# EAGLE schematic Z80 DEV BOARD REV 1 (EAGLE 9.5.2)
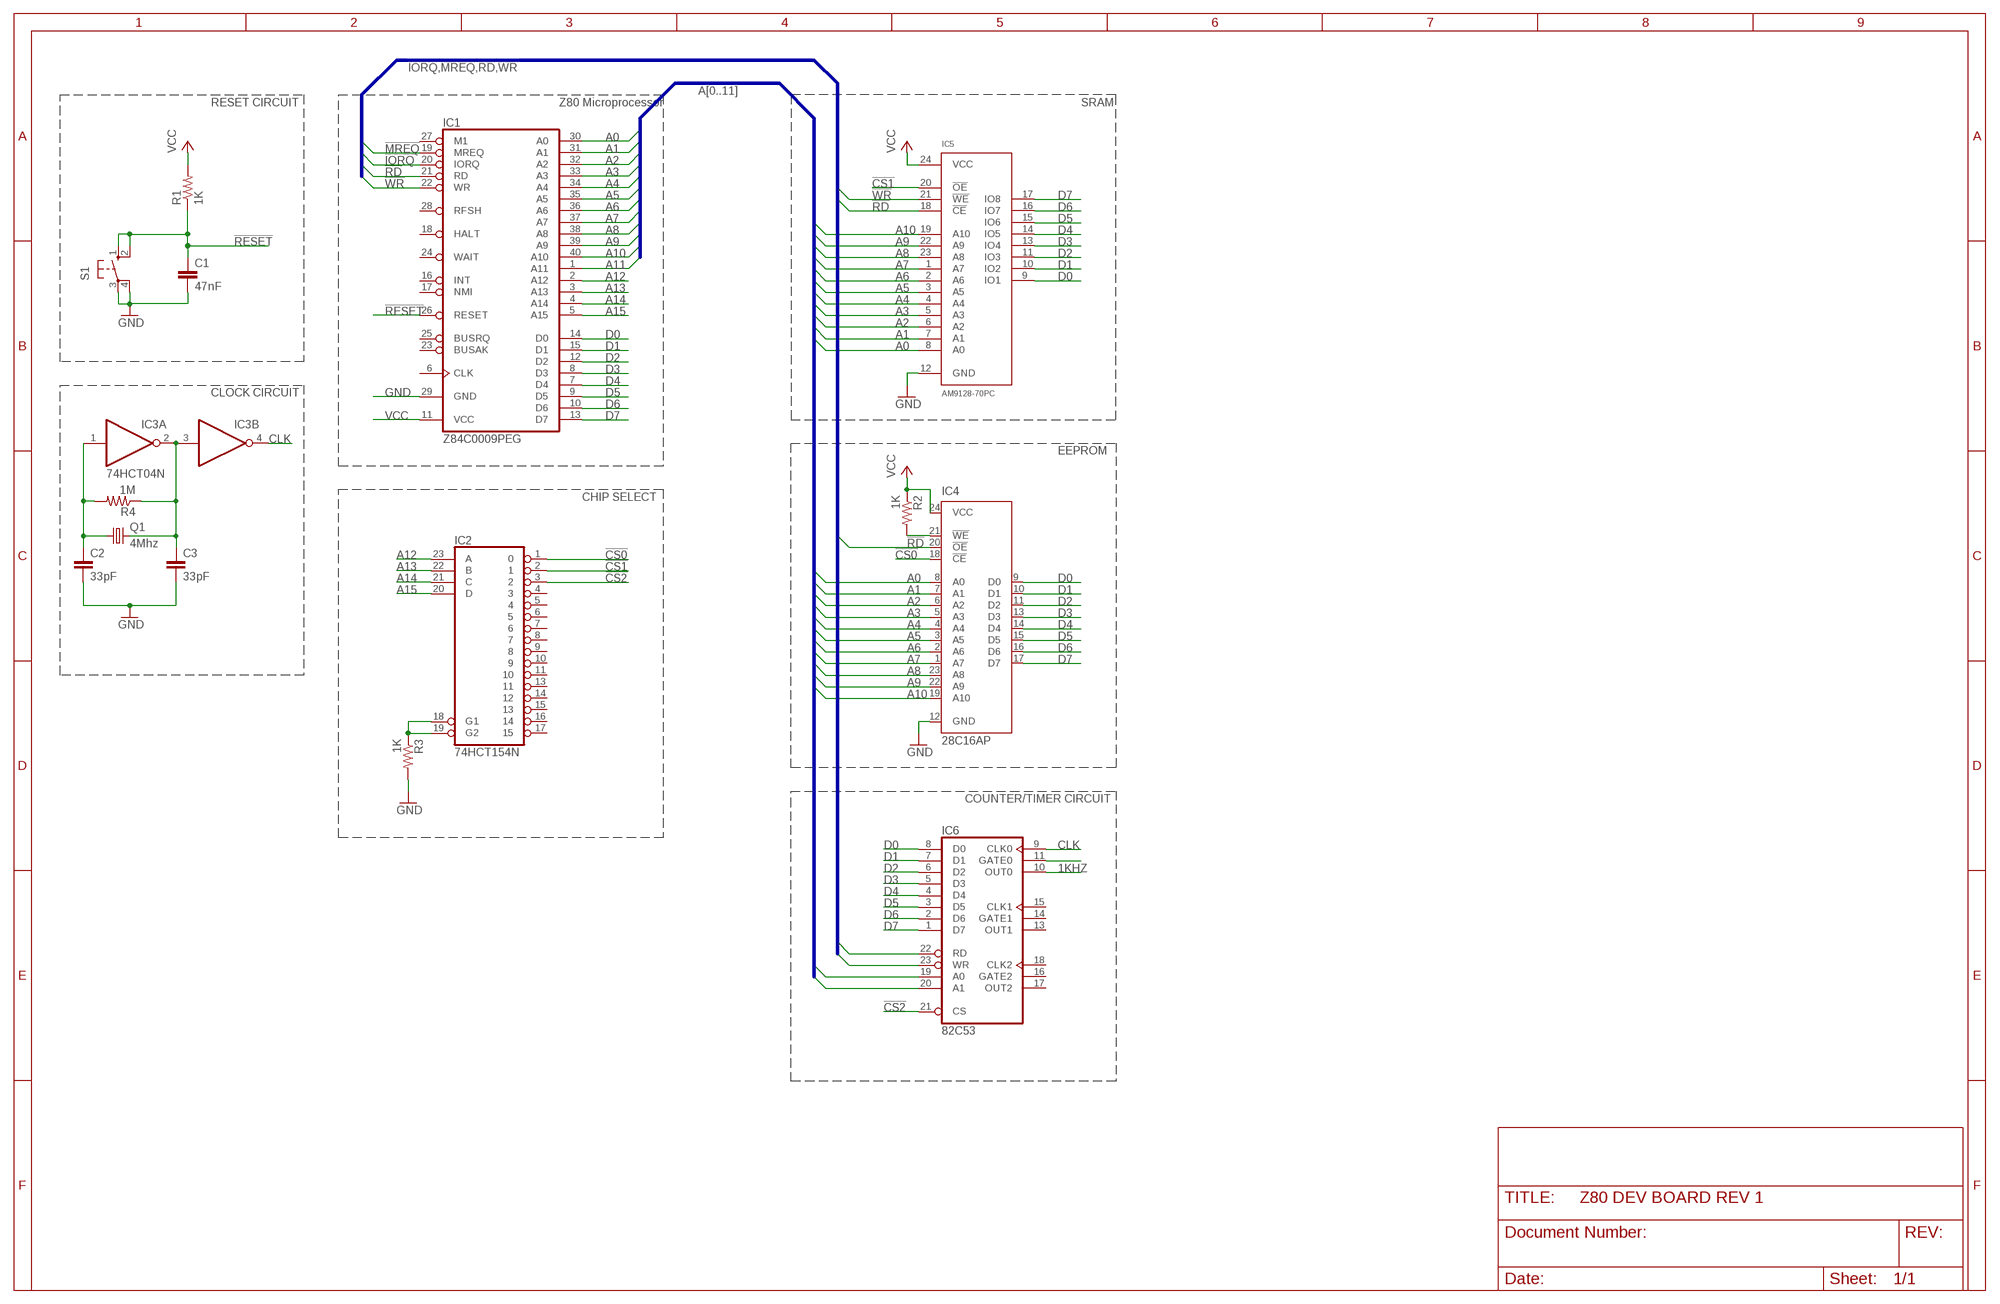
[diagram p0: schematic, sheet 1]

## Parts
C1  47nF  C-EU050-035X075  [C050-035X075]
C2  33pF  C-EU050-035X075  [C050-035X075]
C3  33pF  C-EU050-035X075  [C050-035X075]
IC1  Z84C0009PEG  Z80CPU  [DIL40]
IC2  74HCT154N  [DIL24-6]
IC3  74HCT04N  [DIL14]
IC4  28C16AP  [DIL24-6]
IC5  AM9128-70PC  [DIL24-6]
IC6  82C53  8253  [DIL24-6]
Q1  4Mhz  CRYSTALHC49S  [HC49/S]
R1  1K  R-US_0207/7  [0207/7]
R2  1K  R-US_0207/7  [0207/7]
R3  1K  R-US_0207/7  [0207/7]
R4  1M  R-US_0207/7  [0207/7]
S1  10-XX  [B3F-10XX]

## Nets
1KHZ: IC6.10(OUT0)
!CS0: IC2.1 IC4.18(!CE)
!CS1: IC2.2 IC5.20(!OE)
!CS2: IC2.3 IC6.21(CS)
!IORQ: IC1.20(IORQ)
!MREQ: IC1.19(MREQ)
!RD: IC1.21(RD) IC4.20(!OE) IC5.18(!CE) IC6.22(RD)
!RESET: C1.1 IC1.26(RESET) R1.1 S1.1(S) S1.2(S1)
!WR: IC1.22(WR) IC5.21(!WE) IC6.23(WR)
A0: IC1.30(A0) IC4.8(A0) IC5.8(A0) IC6.19(A0)
A1: IC1.31(A1) IC4.7(A1) IC5.7(A1) IC6.20(A1)
A2: IC1.32(A2) IC4.6(A2) IC5.6(A2)
A3: IC1.33(A3) IC4.5(A3) IC5.5(A3)
A4: IC1.34(A4) IC4.4(A4) IC5.4(A4)
A5: IC1.35(A5) IC4.3(A5) IC5.3(A5)
A6: IC1.36(A6) IC4.2(A6) IC5.2(A6)
A7: IC1.37(A7) IC4.1(A7) IC5.1(A7)
A8: IC1.38(A8) IC4.23(A8) IC5.23(A8)
A9: IC1.39(A9) IC4.22(A9) IC5.22(A9)
A10: IC1.40(A10) IC4.19(A10) IC5.19(A10)
A11: IC1.1(A11)
A12: IC1.2(A12) IC2.23(A)
A13: IC1.3(A13) IC2.22(B)
A14: IC1.4(A14) IC2.21(C)
A15: IC1.5(A15) IC2.20(D)
CLK: IC3.4(B:O) IC6.9(CLK0)
D0: IC1.14(D0) IC4.9(D0) IC5.9(IO1) IC6.8(D0)
D1: IC1.15(D1) IC4.10(D1) IC5.10(IO2) IC6.7(D1)
D2: IC1.12(D2) IC4.11(D2) IC5.11(IO3) IC6.6(D2)
D3: IC1.8(D3) IC4.13(D3) IC5.13(IO4) IC6.5(D3)
D4: IC1.7(D4) IC4.14(D4) IC5.14(IO5) IC6.4(D4)
D5: IC1.9(D5) IC4.15(D5) IC5.15(IO6) IC6.3(D5)
D6: IC1.10(D6) IC4.16(D6) IC5.16(IO7) IC6.2(D6)
D7: IC1.13(D7) IC4.17(D7) IC5.17(IO8) IC6.1(D7)
GND: C1.2 C2.2 C3.2 IC1.29(GND) IC4.12(GND) IC5.12(GND) R3.2 S1.3(P) S1.4(P1)
N$1: C2.1 IC3.1(A:I) Q1.1 R4.2
N$2: IC4.21(!WE) R2.2
N$3: C3.1 IC3.2(A:O) IC3.3(B:I) Q1.2 R4.1
N$4: IC6.11(GATE0)
N$5: IC2.18(G1) IC2.19(G2) R3.1
VCC: IC1.11(VCC) IC4.24(VCC) IC5.24(VCC) R1.2 R2.1
Unconnected: IC1.6(CLK) IC1.16(INT) IC1.17(NMI) IC1.18(HALT) IC1.23(BUSAK) IC1.24(WAIT) IC1.25(BUSRQ) IC1.27(M1) IC1.28(RFSH) IC2.4 IC2.5 IC2.6 IC2.7 IC2.8 IC2.9 IC2.10 IC2.11 IC2.13 IC2.14 IC2.15 IC2.16 IC2.17 IC3.5(C:I) IC3.6(C:O) IC3.8(D:O) IC3.9(D:I) IC3.10(E:O) IC3.11(E:I) IC3.12(F:O) IC3.13(F:I) IC6.13(OUT1) IC6.14(GATE1) IC6.15(CLK1) IC6.16(GATE2) IC6.17(OUT2) IC6.18(CLK2)

## Buses
!IORQ,!MREQ,!RD,!WR
A[0..11]

## Notes on the sheet
- RESET CIRCUIT | Z80 Microprocessor | SRAM
- CLOCK CIRCUIT
- EEPROM
- CHIP SELECT
- COUNTER/TIMER CIRCUIT

## Power pins joined to a net without a drawn wire
GND: IC2.12(GND) IC3.7(P:GND) IC6.12(GND)
VCC: IC2.24(VCC) IC3.14(P:VCC) IC6.24(VCC)

## Library data of the parts
C1-C3 = rcl:C-EU: CAPACITOR, European symbol; SPICEPREFIX: C
IC1 = zilog:Z80CPU: Z80 FAMILY DEVICE
IC2 = 74xx-eu:74*154: 4-line to 16-line data SELECTOR/MULTIPLEXER
IC3 = 74xx-eu:74*04: Hex INVERTER
IC4 = microchip:28*16A: CMOS EPROM 16 K (2 K x 8) Source: ww1.microchip.com/downloads/en/DeviceDoc/11125J.pdf; MPN: CAT28C16ALI-12; OC_FARNELL: 1718292; OC_NEWARK: 06R0648
IC5 = AM9128:AM9128-70PC
IC6 = micro-intel:8253: MICROCOMPUTER/PERIPHERAL DEVICE; OC_FARNELL: unknown; OC_NEWARK: unknown
Q1 = adafruit:CRYSTAL: CRYSTAL; OC_FARNELL: 1667008; OC_NEWARK: unknown
R1-R4 = resistor:R-US_: RESISTOR, American symbol
S1 = switch-omron:10-XX: OMRON SWITCH; MPN: B3F-1000; OC_FARNELL: 176432; OC_NEWARK: 36M3542